# EAGLE design design (EAGLE 7.5.0)
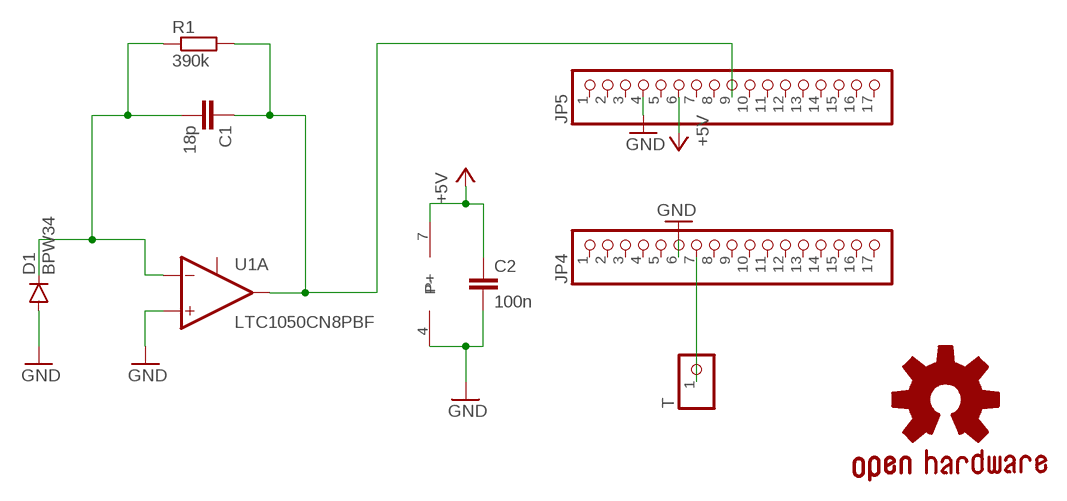
[diagram p0: schematic, sheet 1]

## Parts
C1  18p  C-EU025-025X050  [C025-025X050]
C2  100n  C-EU025-025X050  [C025-025X050]
D1  BPW34  [BPW34]
GOLD_ORB_SM1  OSHWLOGO_GOLD_ORB_SM  [OSHW2]
JP4  PINHD-1X17  [1X17]
JP5  PINHD-1X17  [1X17]
R1  390k  R-EU_0207/2V  [0207/2V]
T  PINHD-1X1  [1X01]
U1  LTC1050CN8PBF  [DIP254P762X508-8]

## Nets
+5V: C2.1 JP5.6 U1.7(B:P+)
GND: C2.2 D1.P$1(A) JP4.6 JP5.4 U1.3(A:IN+) U1.4(B:P-)
N$1: C1.2 D1.P$2(C) R1.1 U1.2(A:IN-)
N$2: C1.1 JP5.9 R1.2 U1.6(A:OUT)
N$4: JP4.7 T.1
Unconnected: JP4.1 JP4.2 JP4.3 JP4.4 JP4.5 JP4.8 JP4.9 JP4.10 JP4.11 JP4.12 JP4.13 JP4.14 JP4.15 JP4.16 JP4.17 JP5.1 JP5.2 JP5.3 JP5.5 JP5.7 JP5.8 JP5.10 JP5.11 JP5.12 JP5.13 JP5.14 JP5.15 JP5.16 JP5.17 U1.5(A:CLK)

## Library data of the parts
C1 C2 = rcl:C-EU: CAPACITOR, European symbol
D1 = SparkFun-Sensors:BPW34: Large-area PIN photodiode ("miniature solar cell") Datasheet: https://www.sparkfun.com/datasheets/Prototyping/Solar/bpw34.pdf; STOREID: 9541
GOLD_ORB_SM1 = bfl:OSHWLOGO: These are Open-Source Hardware logos.
JP4 JP5 = pinhead:PINHD-1X17: PIN HEADER
R1 = rcl:R-EU_: RESISTOR, European symbol
T = pinhead:PINHD-1X1: PIN HEADER
U1 = my librarry:LTC1050CN8PBF: Operational Amplifier; MPN: LTC1050CN8#PBF; OC_FARNELL: 9560769; OC_NEWARK: 55M8938; PACKAGE: PDIP; SUPPLIER: LINEAR TECHNOLOGY

## Board
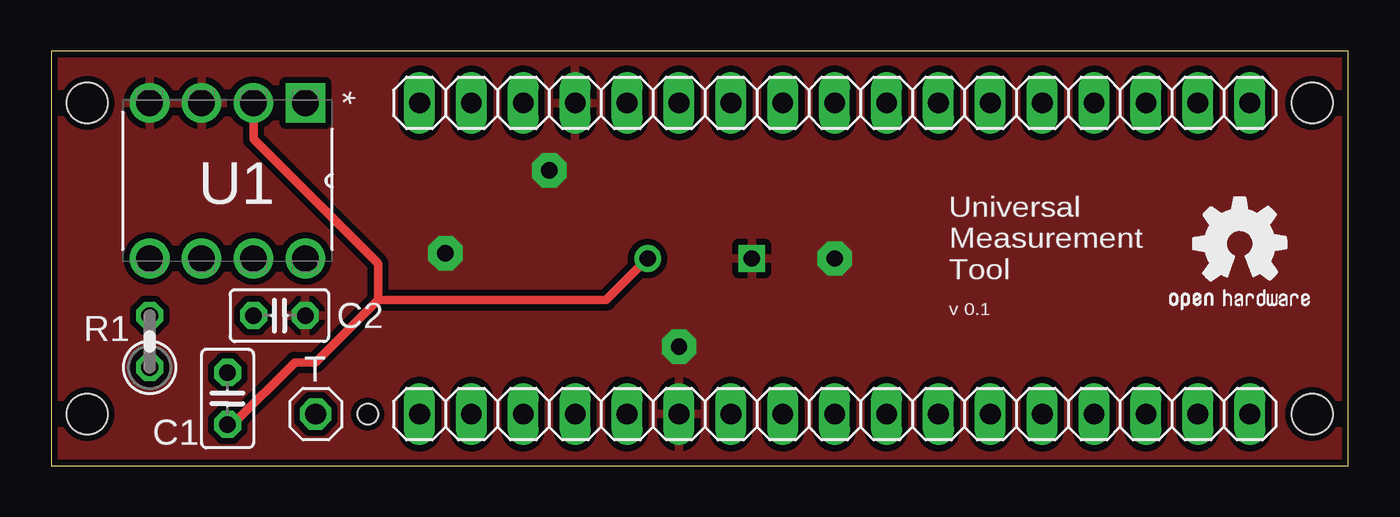
[diagram p1: board, top side]
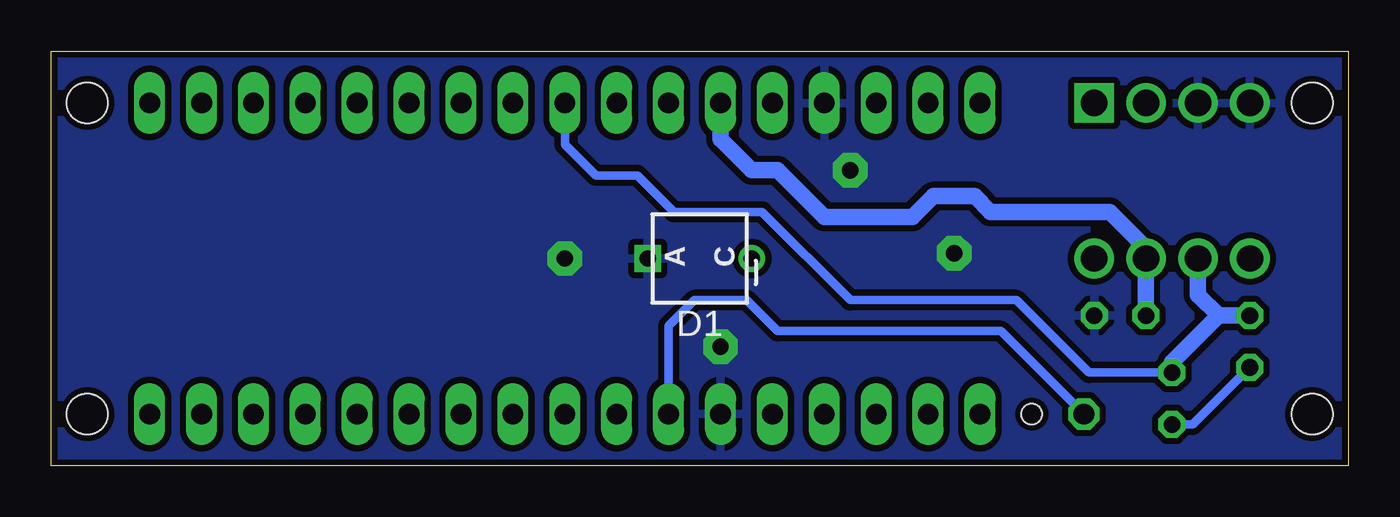
[diagram p2: board, bottom side, seen from below]

Size 63.5 x 20.32 mm. Coordinates in mm from the lower left corner, seen from the top.
Outline: 0,0 63.5,0 63.5,20.32 0,20.32 0,0
Copper layers (1*16): Top 0.035mm / dielectric 1.5mm / Bottom 0.035mm
Design rules "LoetLab": minimum track width 10mil, minimum drill 24mil, track to track 12mil, track to pad 12mil, pad to pad 12mil, via to via 12mil, smd to smd 10mil, copper to edge 12mil, drill to drill 12mil, minimum pad ring 10mil, minimum via ring 10mil, stop-mask expansion 4mil, vias tented up to drill 0mil, thermal gap 12mil
Holes 2 mm at 61.72,2.54 1.78,2.54 1.78,17.78 61.72,17.78
Holes 1 mm at 15.49,2.54

### Footprints (pad centres in the part's own frame; a part is rotated, then mirrored left to right if it is on the bottom)
C025-025X050 = drill 0.813 octagon: 1 -1.27,0; 2 1.27,0
BPW34 = drill 0.8 square: P$1 0,2.55 | drill 0.8: P$2 0,-2.55
1X17 = drill 1.016 long: 1 -20.32,0; 2 -17.78,0; 3 -15.24,0; 4 -12.7,0; 5 -10.16,0; 6 -7.62,0; 7 -5.08,0; 8 -2.54,0; 9 0,0; 10 2.54,0; 11 5.08,0; 12 7.62,0; 13 10.16,0; 14 12.7,0; 15 15.24,0; 16 17.78,0; 17 20.32,0
0207/2V = drill 0.813 octagon: 1 -1.27,0; 2 1.27,0
1X01 = drill 1.016 octagon: 1 0,0
DIP254P762X508-8 = drill 1.295 square: 1 -7.62,7.62 | drill 1.295: 2 -7.62,5.08; 3 -7.62,2.54; 4 -7.62,0; 5 0,0; 6 0,2.54; 7 0,5.08; 8 0,7.62

### Placement (x,y rotation side)
C1  8.64,3.3 270 top
C2  11.18,7.37 0 top
D1  31.75,10.16 90 bottom
GOLD_ORB_SM1  54.36,6.6 0 top
JP4  38.35,2.54 0 top
JP5  38.35,17.78 0 top
R1  4.83,6.1 90 top
T  12.95,2.54 0 top
U1  4.83,10.16 270 top

### Tracks (layer width: path | path; a pad name or v marks a point on that pad's centre or on a via)
+5V
  Bottom 0.813: C2.1 U1.7 9.91,10.67 11.68,12.45 17.53,12.45 18.29,13.21 20.32,13.21 21.34,12.19 25.65,12.19 27.94,14.48 29.21,14.48 30.73,16 JP5.6
GND  (via drill 0.8 pad 1.68)
  other vias: 38.35,10.16 19.3,10.41 24.38,14.48 30.73,5.84
  pour Top: 0,0 0,20.32 63.5,20.32 63.5,0
  pour Bottom: 0,0 0,20.32 63.5,20.3 63.5,0
N$1
  Top 0.406: U1.2 9.91,16 16,9.91 16,8.13 | 16,8.13 27.17,8.13 D1.P$2 | 16,8.13 12.95,5.08 11.94,5.08 8.89,2.03 C1.2
  Bottom 0.406: C1.2 7.62,2.03 R1.1
N$2
  Bottom 0.406: JP5.9 38.35,15.75 36.83,14.22 34.8,14.22 33.02,12.45 28.7,12.45 24.38,8.13 16.26,8.13 12.7,4.57 C1.1
  Bottom 0.813: C1.1 8.64,5.08 6.35,7.37 | 6.35,7.37 R1.2 | U1.6 7.37,8.38 6.35,7.37
N$4
  Bottom 0.406: T.1 17.02,6.6 27.94,6.6 29.46,8.13 32,8.13 33.27,6.86 JP4.7

### Text on the board
tNames: Universal / Measurement / Tool | v 0.1